# Altium schematic sheet System Control - Bank1.SchDoc
size C
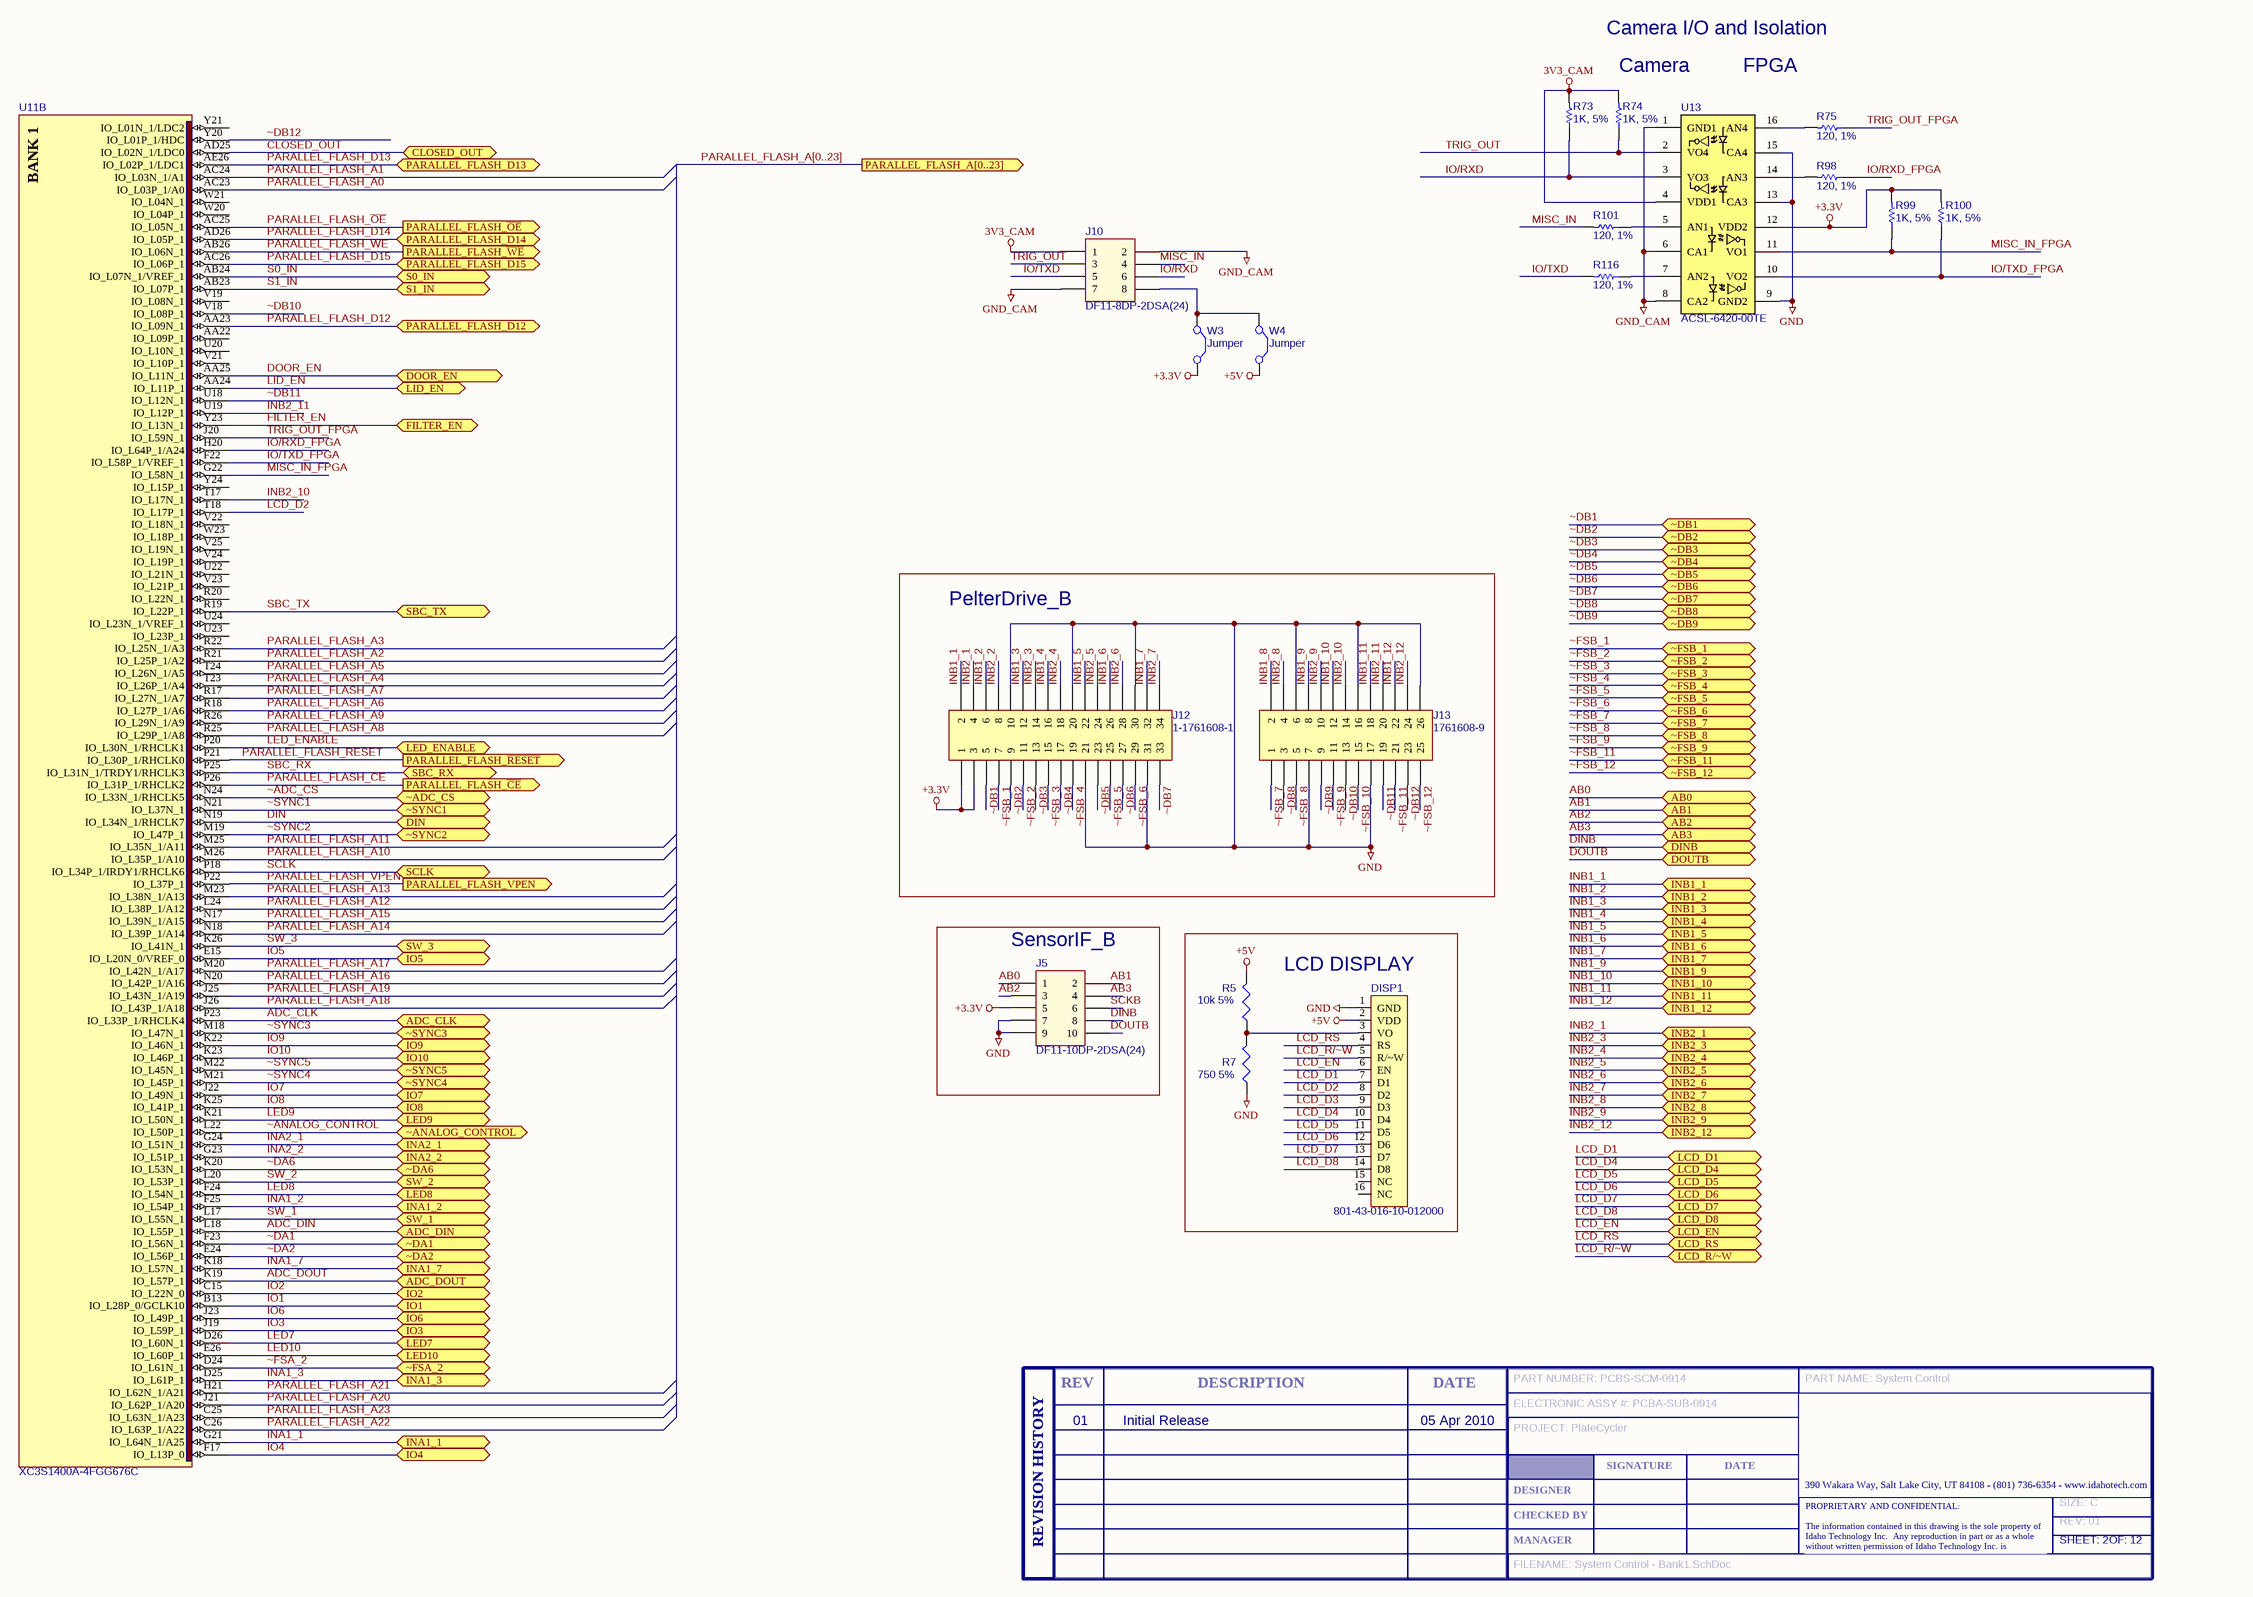
[diagram p0: System Control - Bank1.SchDoc]

## Parts
DISP1  Manufacturer P/N: 801-43-016-10-012000  [LCD_HEADER_16X2_2 - SIMPLE]  (hidden comment: LCD_HEADER_1X16_1)
J5  Manufacturer P/N: DF11-10DP-2DSA(24)  [HEADER_2X5_1]  (hidden comment: Sensor I/F B)
J10  Manufacturer P/N: DF11-8DP-2DSA(24)  [HEADER_2X4_1]  (hidden comment: HEADER_2X4_1)
J12  Manufacturer P/N: 1-1761608-1  [HEADER_2X17_2]
J13  Manufacturer P/N: 1761608-9  [HEADER_2X13_2]
R5  10k 5%  [0603]
R7  750 5%  [0603]
R73  value 1K, 5%  [0603]  (hidden comment: Res1)
R74  value 1K, 5%  [0603]  (hidden comment: Res1)
R75  value 120, 1%  [0603]  (hidden comment: Res1)
R98  value 120, 1%  [0603]  (hidden comment: Res1)
R99  value 1K, 5%  [0603]  (hidden comment: Res1)
R100  value 1K, 5%  [0603]  (hidden comment: Res1)
R101  value 120, 1%  [0603]  (hidden comment: Res1)
R116  value 120, 1%  [0603]  (hidden comment: Res1)
T?  SIZE: C  REV: 01  FILENAME: System Control - Bank1.SchDoc  PART NUMBER: PCBS-SCM-0914  PART NAME: System Control  ELECTRONIC ASSY #: PCBA-SUB-0914  PROJECT: PlateCycler  SHEET: 2  OF: 12  (hidden comment: ITI Title Block, A Size)  (graphical)
U11  XC3S1400A-4FGG676C  [FGG676]  (part B of 9)
U13  Manufacturer P/N: ACSL-6420-00TE  [SO-16_SMALL_OUTLINE]  (hidden comment: OPTO_ISO_4_1)
W3  Jumper  [HDR1X2]
W4  Jumper  [HDR1X2]

## Blocks framed on the sheet
PelterDrive_B: J12 J13
SensorIF_B: J5
LCD DISPLAY: DISP1 R5 R7

## Ports
AB0, AB1, AB2, AB3, ADC_CLK, ADC_DIN, ADC_DOUT, CLOSED_OUT, DIN, DINB, DOOR_EN, DOUTB, FILTER_EN, INA1_1, INA1_2, INA1_3, INA1_7, INA2_1, INA2_2, INB1_1, INB1_2, INB1_3, INB1_4, INB1_5, INB1_6, INB1_7, INB1_9, INB1_10, INB1_11, INB1_12, INB2_1, INB2_3, INB2_4, INB2_5, INB2_6, INB2_7, INB2_8, INB2_9, INB2_12, IO1, IO2, IO3, IO4, IO5, IO6, IO7, IO8, IO9, IO10, LCD_D1, LCD_D4, LCD_D5, LCD_D6, LCD_D7, LCD_D8, LCD_EN, LCD_R/~W, LCD_RS, LED7, LED8, LED9, LED10, LED_ENABLE, LID_EN, PARALLEL_FLASH_A[0..23] (out), PARALLEL_FLASH_D12, PARALLEL_FLASH_D13, PARALLEL_FLASH_D14, PARALLEL_FLASH_D15, PARALLEL_FLASH_VPEN (out), PARALLEL_FLASH_~{CE} (out), PARALLEL_FLASH_~{OE} (out), PARALLEL_FLASH_~{RESET} (out), PARALLEL_FLASH_~{WE} (out), S0_IN, S1_IN, SBC_RX, SBC_TX, SCLK, SW_1, SW_2, SW_3, ~ADC_CS, ~ANALOG_CONTROL, ~DA1, ~DA2, ~DA6, ~DB1, ~DB2, ~DB3, ~DB4, ~DB5, ~DB6, ~DB7, ~DB8, ~DB9, ~FSA_2, ~FSB_1, ~FSB_2, ~FSB_3, ~FSB_4 (bidir), ~FSB_5, ~FSB_6, ~FSB_7, ~FSB_8, ~FSB_9, ~FSB_11, ~FSB_12, ~SYNC1, ~SYNC2, ~SYNC3, ~SYNC4, ~SYNC5

## Nets
3V3_CAM: J10.1 R73.2 R74.2 U13.4(VDD1)
+3.3V: J5.5 J12.1 J12.3 R99.2 R100.2 U13.12(VDD2) W3.2(C2)
+5V: DISP1.2(VDD) R5.2 W4.2(C2)
GND: DISP1.1(GND) J5.7 J5.9 J12.10 J12.20 J12.21 J12.30 J12.31 J13.6 J13.7 J13.16 J13.17 J13.26 R7.1 U13.9(GND2) U13.13(CA3) U13.15(CA4)
GND_CAM: J10.2 J10.7 U13.1(GND1) U13.6(CA1) U13.8(CA2)
AB0: J5.1 ; port AB0
AB1: J5.2 ; port AB1
AB2: J5.3 ; port AB2
AB3: J5.4 ; port AB3
ADC_CLK: U11.P23(IO_L33P_1/RHCLK4) ; port ADC_CLK
ADC_DIN: U11.L18(IO_L55P_1) ; port ADC_DIN
ADC_DOUT: U11.K19(IO_L57P_1) ; port ADC_DOUT
CLOSED_OUT: U11.AD25(IO_L02N_1/LDC0) ; port CLOSED_OUT
DIN: U11.N19(IO_L34N_1/RHCLK7) ; port DIN
DINB: J5.8 ; port DINB
DOOR_EN: U11.AA25(IO_L11N_1) ; port DOOR_EN
DOUTB: J5.10 ; port DOUTB
FILTER_EN: U11.Y23(IO_L13N_1) ; port FILTER_EN
INA1_1: U11.G21(IO_L64N_1/A25) ; port INA1_1
INA1_2: U11.F25(IO_L54P_1) ; port INA1_2
INA1_3: U11.D25(IO_L61P_1) ; port INA1_3
INA1_7: U11.K18(IO_L57N_1) ; port INA1_7
INA2_1: U11.G24(IO_L51N_1) ; port INA2_1
INA2_2: U11.G23(IO_L51P_1) ; port INA2_2
INB1_1: J12.2 ; port INB1_1
INB1_2: J12.6 ; port INB1_2
INB1_3: J12.12 ; port INB1_3
INB1_4: J12.16 ; port INB1_4
INB1_5: J12.22 ; port INB1_5
INB1_6: J12.26 ; port INB1_6
INB1_7: J12.32 ; port INB1_7
INB1_8: J13.2
INB1_9: J13.8 ; port INB1_9
INB1_10: J13.12 ; port INB1_10
INB1_11: J13.18 ; port INB1_11
INB1_12: J13.22 ; port INB1_12
INB2_1: J12.4 ; port INB2_1
INB2_2: J12.8
INB2_3: J12.14 ; port INB2_3
INB2_4: J12.18 ; port INB2_4
INB2_5: J12.24 ; port INB2_5
INB2_6: J12.28 ; port INB2_6
INB2_7: J12.34 ; port INB2_7
INB2_8: J13.4 ; port INB2_8
INB2_9: J13.10 ; port INB2_9
INB2_10: J13.14 U11.T17(IO_L17N_1)
INB2_11: J13.20 U11.U19(IO_L12P_1)
INB2_12: J13.24 ; port INB2_12
IO1: U11.B13(IO_L28P_0/GCLK10) ; port IO1
IO2: U11.C15(IO_L22N_0) ; port IO2
IO3: U11.J19(IO_L59P_1) ; port IO3
IO4: U11.F17(IO_L13P_0) ; port IO4
IO5: U11.E15(IO_L20N_0/VREF_0) ; port IO5
IO6: U11.J23(IO_L49P_1) ; port IO6
IO7: U11.J22(IO_L49N_1) ; port IO7
IO8: U11.K25(IO_L41P_1) ; port IO8
IO9: U11.K22(IO_L46N_1) ; port IO9
IO10: U11.K23(IO_L46P_1) ; port IO10
IO/RXD: J10.6 R73.1 U13.3(VO3)
IO/RXD_FPGA: R98.1 U11.H20(IO_L64P_1/A24)
IO/TXD: J10.5 R116.2
IO/TXD_FPGA: R100.1 U11.F22(IO_L58P_1/VREF_1) U13.10(VO2)
LCD_D1: DISP1.7(D1) ; port LCD_D1
LCD_D2: DISP1.8(D2) U11.T18(IO_L17P_1)
LCD_D3: DISP1.9(D3)
LCD_D4: DISP1.10(D4) ; port LCD_D4
LCD_D5: DISP1.11(D5) ; port LCD_D5
LCD_D6: DISP1.12(D6) ; port LCD_D6
LCD_D7: DISP1.13(D7) ; port LCD_D7
LCD_D8: DISP1.14(D8) ; port LCD_D8
LCD_EN: DISP1.6(EN) ; port LCD_EN
LCD_R/~W: DISP1.5(R/~W) ; port LCD_R/~W
LCD_RS: DISP1.4(RS) ; port LCD_RS
LED7: U11.D26(IO_L60N_1) ; port LED7
LED8: U11.F24(IO_L54N_1) ; port LED8
LED9: U11.K21(IO_L50N_1) ; port LED9
LED10: U11.E26(IO_L60P_1) ; port LED10
LED_ENABLE: U11.P20(IO_L30N_1/RHCLK1) ; port LED_ENABLE
LID_EN: U11.AA24(IO_L11P_1) ; port LID_EN
MISC_IN: J10.4 R101.2
MISC_IN_FPGA: R99.1 U11.G22(IO_L58N_1) U13.11(VO1)
PARALLEL_FLASH_A0: U11.AC23(IO_L03P_1/A0)
PARALLEL_FLASH_A1: U11.AC24(IO_L03N_1/A1)
PARALLEL_FLASH_A2: U11.R21(IO_L25P_1/A2)
PARALLEL_FLASH_A3: U11.R22(IO_L25N_1/A3)
PARALLEL_FLASH_A4: U11.T23(IO_L26P_1/A4)
PARALLEL_FLASH_A5: U11.T24(IO_L26N_1/A5)
PARALLEL_FLASH_A6: U11.R18(IO_L27P_1/A6)
PARALLEL_FLASH_A7: U11.R17(IO_L27N_1/A7)
PARALLEL_FLASH_A8: U11.R25(IO_L29P_1/A8)
PARALLEL_FLASH_A9: U11.R26(IO_L29N_1/A9)
PARALLEL_FLASH_A10: U11.M26(IO_L35P_1/A10)
PARALLEL_FLASH_A11: U11.M25(IO_L35N_1/A11)
PARALLEL_FLASH_A12: U11.L24(IO_L38P_1/A12)
PARALLEL_FLASH_A13: U11.M23(IO_L38N_1/A13)
PARALLEL_FLASH_A14: U11.N18(IO_L39P_1/A14)
PARALLEL_FLASH_A15: U11.N17(IO_L39N_1/A15)
PARALLEL_FLASH_A16: U11.N20(IO_L42P_1/A16)
PARALLEL_FLASH_A17: U11.M20(IO_L42N_1/A17)
PARALLEL_FLASH_A18: U11.J26(IO_L43P_1/A18)
PARALLEL_FLASH_A19: U11.J25(IO_L43N_1/A19)
PARALLEL_FLASH_A20: U11.J21(IO_L62P_1/A20)
PARALLEL_FLASH_A21: U11.H21(IO_L62N_1/A21)
PARALLEL_FLASH_A22: U11.C26(IO_L63P_1/A22)
PARALLEL_FLASH_A23: U11.C25(IO_L63N_1/A23)
PARALLEL_FLASH_~{CE}: U11.P26(IO_L31P_1/RHCLK2) ; port PARALLEL_FLASH_~{CE}
PARALLEL_FLASH_D12: U11.AA23(IO_L09N_1) ; port PARALLEL_FLASH_D12
PARALLEL_FLASH_D13: U11.AE26(IO_L02P_1/LDC1) ; port PARALLEL_FLASH_D13
PARALLEL_FLASH_D14: U11.AD26(IO_L05P_1) ; port PARALLEL_FLASH_D14
PARALLEL_FLASH_D15: U11.AC26(IO_L06P_1) ; port PARALLEL_FLASH_D15
PARALLEL_FLASH_~{OE}: U11.AC25(IO_L05N_1) ; port PARALLEL_FLASH_~{OE}
PARALLEL_FLASH_~{RESET}: U11.P21(IO_L30P_1/RHCLK0) ; port PARALLEL_FLASH_~{RESET}
PARALLEL_FLASH_VPEN: U11.P22(IO_L37P_1) ; port PARALLEL_FLASH_VPEN
PARALLEL_FLASH_~{WE}: U11.AB26(IO_L06N_1) ; port PARALLEL_FLASH_~{WE}
S0_IN: U11.AB24(IO_L07N_1/VREF_1) ; port S0_IN
S1_IN: U11.AB23(IO_L07P_1) ; port S1_IN
SBC_RX: U11.P25(IO_L31N_1/TRDY1/RHCLK3) ; port SBC_RX
SBC_TX: U11.R19(IO_L22P_1) ; port SBC_TX
SCKB: J5.6
SCLK: U11.P18(IO_L34P_1/IRDY1/RHCLK6) ; port SCLK
SW_1: U11.L17(IO_L55N_1) ; port SW_1
SW_2: U11.L20(IO_L53P_1) ; port SW_2
SW_3: U11.K26(IO_L41N_1) ; port SW_3
TRIG_OUT: J10.3 R74.1 U13.2(VO4)
TRIG_OUT_FPGA: R75.1 U11.J20(IO_L59N_1)
~ADC_CS: U11.N24(IO_L33N_1/RHCLK5) ; port ~ADC_CS
~ANALOG_CONTROL: U11.L22(IO_L50P_1) ; port ~ANALOG_CONTROL
~DA1: U11.F23(IO_L56N_1) ; port ~DA1
~DA2: U11.E24(IO_L56P_1) ; port ~DA2
~DA6: U11.K20(IO_L53N_1) ; port ~DA6
~DB1: J12.5 ; port ~DB1
~DB2: J12.9 ; port ~DB2
~DB3: J12.13 ; port ~DB3
~DB4: J12.17 ; port ~DB4
~DB5: J12.23 ; port ~DB5
~DB6: J12.27 ; port ~DB6
~DB7: J12.33 ; port ~DB7
~DB8: J13.3 ; port ~DB8
~DB9: J13.9 ; port ~DB9
~DB10: J13.13 U11.V18(IO_L08P_1)
~DB11: J13.19 U11.U18(IO_L12N_1)
~DB12: J13.23 U11.Y20(IO_L01P_1/HDC)
~FSA_2: U11.D24(IO_L61N_1) ; port ~FSA_2
~FSB_1: J12.7 ; port ~FSB_1
~FSB_2: J12.11 ; port ~FSB_2
~FSB_3: J12.15 ; port ~FSB_3
~FSB_4: J12.19 ; port ~FSB_4
~FSB_5: J12.25 ; port ~FSB_5
~FSB_6: J12.29 ; port ~FSB_6
~FSB_7: J13.1 ; port ~FSB_7
~FSB_8: J13.5 ; port ~FSB_8
~FSB_9: J13.11 ; port ~FSB_9
~FSB_10: J13.15
~FSB_11: J13.21 ; port ~FSB_11
~FSB_12: J13.25 ; port ~FSB_12
~SYNC1: U11.N21(IO_L37N_1) ; port ~SYNC1
~SYNC2: U11.M19(IO_L47P_1) ; port ~SYNC2
~SYNC3: U11.M18(IO_L47N_1) ; port ~SYNC3
~SYNC4: U11.M21(IO_L45P_1) ; port ~SYNC4
~SYNC5: U11.M22(IO_L45N_1) ; port ~SYNC5
NetDISP1_3: DISP1.3(VO) R5.1 R7.2
NetJ10_8: J10.8 W3.1(C1) W4.1(C1)
NetR75_2: R75.2 U13.16(AN4)
NetR98_2: R98.2 U13.14(AN3)
NetR101_1: R101.1 U13.5(AN1)
NetR116_1: R116.1 U13.7(AN2)

Not connected (* = marked no-connect by the designer): DISP1 15(NC) 16(NC); U11 AA22(IO_L09P_1) R20(IO_L22N_1) U20(IO_L10N_1) U22(IO_L21N_1) U23(IO_L23P_1) U24(IO_L23N_1/VREF_1) V19(IO_L08N_1) V21(IO_L10P_1) V22(IO_L18N_1) V23(IO_L21P_1) V24(IO_L19P_1) V25(IO_L19N_1) W20(IO_L04P_1) W21(IO_L04N_1) W23(IO_L18P_1) Y21(IO_L01N_1/LDC2) Y24(IO_L15P_1)

## Buses and harness runs
bus PARALLEL_FLASH_A[0..23] = port PARALLEL_FLASH_A[0..23]

## Notes on the sheet
- Camera I/O and Isolation
- (near R74) Camera
- FPGA
- 01
- Initial Release
- 05 Apr 2010
- (in symbol ITI A-size Title Block and Rev Table) REV; DESCRIPTION; DATE; SIGNATURE; 390 Wakara Way, Salt Lake City, UT 84108 - (801) 736-6354 - www.idahotech.com; DESIGNER; CHECKED BY; REVISION HISTORY; MANAGER; PROPRIETARY AND CONFIDENTIAL: / The information contained in this drawing is the sole property of / Idaho Technology Inc.  Any reproduction in part or as a whole / without written permission of Idaho Technology Inc. is prohibited.
- (in symbol XC3S1400A-4FGG676C, part B) BANK 1

## Library data of the parts
DISP1 = LCD_HEADER_1X16_1: CONN SOCKET STRIP LOPRO 16 PIN; Manufacturer: MILL-MAX CORP; Vendor: DIGIKEY; Vendor P/N: ED6516-ND; NOTE: FOR USE WITH LUMEX LCM-S01602DTR/A 16X2 CHARACTER LCD DISPLAY (DIGIKEY 67-1779-ND); Price: 3.32
J5 = HEADER_2X5_1: CONN HEADER 10POS 2MM PCB TIN; Manufacturer: HIROSE; Vendor: DIGIKEY; Vendor P/N: H10232-ND; Price: 0.65
J10 = HEADER_2X4_1: CONN HEADER 8POS 2MM PCB TIN; Manufacturer: HIROSE; Vendor: DIGIKEY; Vendor P/N: H10231-ND; Price: 0.57
J12 = Header 17X2: CONN HEADER LOPRO STR .100 34POS; Manufacturer: Tyco; Vendor: Digikey; Vendor P/N: A31188-ND
J13 = Header 13X2: CONN HEADER LOPRO STR .100 26POS; Manufacturer: Tyco; Vendor: Digikey; Vendor P/N: A31187-ND; Price: 5.26
R5 = RESISTOR_0_Dup1: RES 10K OHM 1/10W 5% 0603 SMD; Manufacturer: Panasonic; Manufacturer P/N: ERJ-3GEYJ103V; Vendor: Digikey; Vendor P/N: P10KGCT-ND
R7 = RESISTOR_0_Dup1: RES 750 OHM 1/10W 5% 0603 SMD; Manufacturer: Panasonic; Manufacturer P/N: ERJ-3GEYJ751V; Vendor: Digikey; Vendor P/N: P750GCT-ND
R73 R74 R99 R100 = Res1: RES 1.0K OHM 1/10W 5% 0603 SMD; Manufacturer: PANASONIC - ECG; Manufacturer P/N: ERJ-3GEYJ102V; Vendor: DIGIKEY; Vendor P/N: P1.0KGCT-ND; IT P/N: N/A; Price: 0.71
R75 R98 R101 R116 = Res1: RES 120 OHM 1/10W 1% 0603 SMD; Manufacturer: PANASONIC - ECG; Manufacturer P/N: ERJ-3EKF1200V; Vendor: DIGIKEY; Vendor P/N: P120HCT-ND; IT P/N: N/A; Price: 0.073
T? = ITI A-size Title Block and Rev Table: ITI Title Block and Rev Table, A Size
U11 = XC3S1400A-4FGG676C: Spartan-3A  I/O Optimized FPGA, 502 User I/Os, 676-Pin Pb-Free FBGA, Standard Performance, Commercial Grade; Published: 12-Dec-2006; DatasheetVersion: 08-May-2007; PackageVersion: ver1.2.1, Apr-2005; PackageReference: FGG676; Publisher: Altium Limited; PackageDescription: 676-Ball Fine Pitch Ball Grid Array (FGG676) - Pb-Free; Code_JEDEC: MS-034-AAL-1; Code_IPC: BGA100P26X26-676; ComponentLink1Description: Manufacturer Link; ComponentLink1URL: http://www.xilinx.com/products/silicon_solutions/fpgas/spartan_series/spartan3a_fpgas/index.htm; ComponentLink2Description: Datasheet; ComponentLink2URL: http://direct.xilinx.com/bvdocs/publications/ds529.pdf
U13 = OPTO_ISO_4_1: IC, OPTOCOUPLER, QUAD, BIDIR, 16-SOIC; Manufacturer: AVAGO TECHNOLOGIES; Vendor: DIGIKEY; Vendor P/N: 516-1733-5-ND; Price: 8.10
W3 W4 = Jumper: CONN HEADER 2POS .100" STR TIN; Manufacturer: Molex; Manufacturer P/N: 90120-0122; Vendor: Digikey; Vendor P/N: WM8072-ND; Published: 24-Mar-1999; LatestRevisionDate: 17-Jul-2002; LatestRevisionNote: Re-released for DXP Platform.; PackageReference: RAD-0.2; Publisher: Altium Limited